# Altium schematic sheet esquema.SchDoc
size A4; SheetNumber: 1; SheetTotal: 1; Titulo: CIRCUITO BOMBA- PRACTICO; Alumno: GRUPO 16; profesor: -; curso: 6to B; TPN: -; NLista: -; Asignatura: PROYECTO; Año: 2020; Rule: PcbType=ProtelPcb
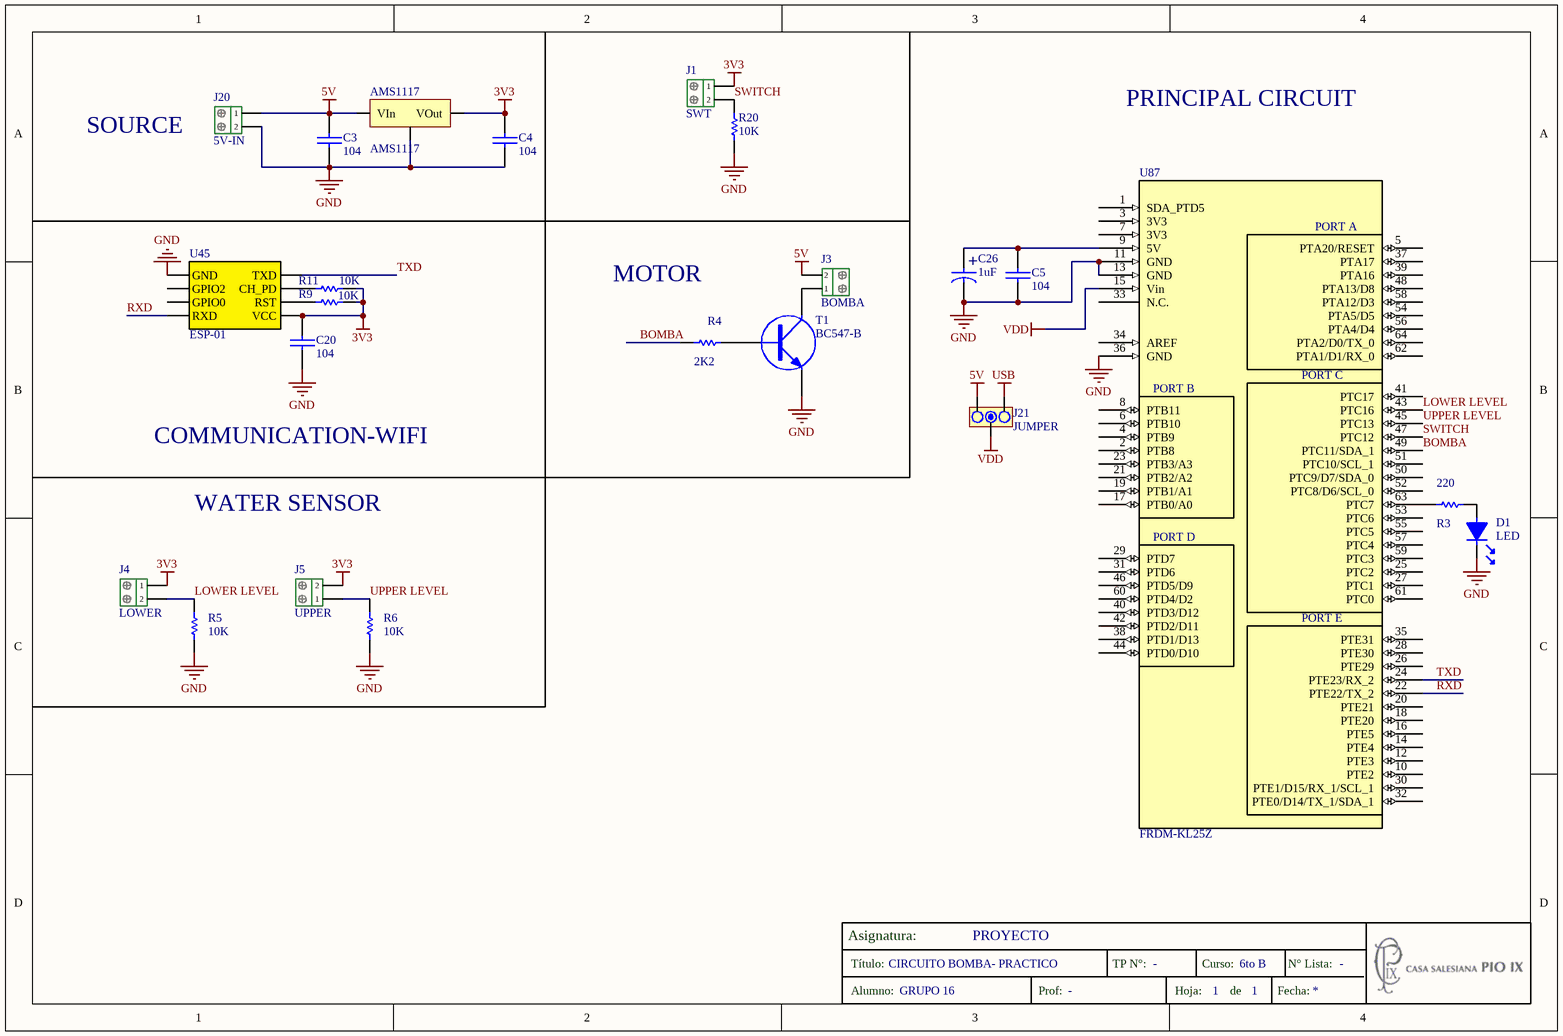
[diagram p0: esquema.SchDoc]

## Parts
AMS1117  AMS1117  [AMS1117]
C3  104  [1206]
C4  104  [0805]
C5  104  [0805]
C20  104  [0805]
C26  1uF  [CAP100RP]
D1  LED  [LED5]
J1  SWT  [BORNERA2]
J3  BOMBA  [BORNERA2]
J4  LOWER  [BORNERA2]
J5  UPPER  [BORNERA2]
J20  5V-IN  [BORNERA2]
J21  JUMPER  [SIP3]
R3  220  [0805]
R4  2K2  [0805]
R5  10K  [0805]
R6  10K  [0805]
R9  10K  [0805]
R11  10K  [0805]
R20  10K  [0805]
T1  BC547-B  [SOT23]
U45  ESP-01  [ESP-01]
U87  FRDM-KL25Z  [MICRO]

## Nets
3V3: AMS1117.3(VOut) C4.1 C20.1 J1.1 J4.1 J5.2 R9.1 R11.1 U45.8(VCC)
5V: AMS1117.1(VIn) C3.1 J3.2 J20.1 J21.1
GND: AMS1117.2(GND) C3.2 C4.2 C5.1 C20.2 C26.2 D1.2 J20.2 R5.1 R6.1 R20.2 T1.3(E) U45.1(GND) U87.11(GND) U87.13(GND) U87.36(GND)
USB: J21.3
VDD: J21.2 U87.15(Vin)
BOMBA: R4.2 U87.49(PTC11/SDA_1)
LOWER LEVEL: J4.2 R5.2 U87.43(PTC16)
RXD: U45.4(RXD) U87.22(PTE22/TX_2)
SWITCH: J1.2 R20.1 U87.47(PTC12)
TXD: U45.5(TXD) U87.24(PTE23/RX_2)
UPPER LEVEL: J5.1 R6.2 U87.45(PTC13)
NetC5_2: C5.2 C26.1 U87.9(5V)
NetD1_1: D1.1 R3.1
NetJ3_1: J3.1 T1.2(C)
NetR3_2: R3.2 U87.63(PTC7)
NetR4_1: R4.1 T1.1(B)
NetR9_2: R9.2 U45.7(RST)
NetR11_2: R11.2 U45.6(CH_PD)

Not connected (* = marked no-connect by the designer): U45 2(GPIO2) 3(GPIO0); U87 1(SDA_PTD5) 2(PTB8) 3(3V3) 4(PTB9) 5(PTA20/RESET) 6(PTB10) 7(3V3) 8(PTB11) 10(PTE2) 12(PTE3) 14(PTE4) 16(PTE5) 17(PTB0/A0) 18(PTE20) 19(PTB1/A1) 20(PTE21) 21(PTB2/A2) 23(PTB3/A3) 25(PTC2) 26(PTE29) 27(PTC1) 28(PTE30) 29(PTD7) 30(PTE1/D15/RX_1/SCL_1) 31(PTD6) 32(PTE0/D14/TX_1/SDA_1) 33(N.C.) 34(AREF) 35(PTE31) 37(PTA17) 38(PTD1/D13) 39(PTA16) 40(PTD3/D12) 41(PTC17) 42(PTD2/D11) 44(PTD0/D10) 46(PTD5/D9) 48(PTA13/D8) 50(PTC9/D7/SDA_0) 51(PTC10/SCL_1) 52(PTC8/D6/SCL_0) 53(PTC6) 54(PTA5/D5) 55(PTC5) 56(PTA4/D4) 57(PTC4) 58(PTA12/D3) 59(PTC3) 60(PTD4/D2) 61(PTC0) 62(PTA1/D1/RX_0) 64(PTA2/D0/TX_0)

## Notes on the sheet
- PRINCIPAL CIRCUIT
- SOURCE
- MOTOR
- COMMUNICATION-WIFI
- WATER SENSOR
- Asignatura:
- Título:
- TP N°:
- Curso:
- N° Lista:
- Alumno:
- Prof:
- Hoja:
- de
- Fecha:
- (in symbol CAPPOL) +
- (in symbol FRDM-KL25Z) PORT A; PORT C; PORT B; PORT D; PORT E

## Library data of the parts
C3-C5 C20 = CAP: Autor: Guido Spataro; Data: Libebal; Fecha: 07/04/19
C26 = CAPPOL: Cap polarizado
J1 J3-J5 J20 = Bornera_2: Bornera de 2 pines; Autor: Guido Spataro; Datasheet: Libebal; Fecha: 07/04/19
J21 = JUMPER3
R3-R6 R9 R11 R20 = RES: Resistencia; Autor: Guido Spataro; Data: Libebal; Fecha: 07/04/19
T1 = TRANSISTOR NPN
U87 = FRDM-KL25Z: Autor: Guido Spataro; data: https://www.nxp.com/docs/en/data-sheet/MC9S08SH8.pdf; Fecha: 07/04/19